# Altium schematic sheet Main.SchDoc
size A3; SheetNumber: 1; SheetTotal: 1
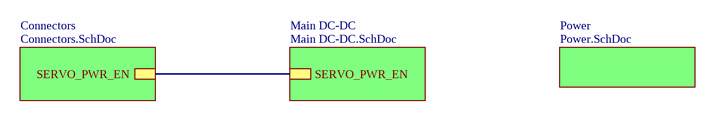
[diagram p0: Main.SchDoc]

## Sub-sheets
Connectors = Connectors.SchDoc: SERVO_PWR_EN
Main DC-DC = Main DC-DC.SchDoc: SERVO_PWR_EN
Power = Power.SchDoc: no entries

## Nets
(unnamed): sheet Connectors/SERVO_PWR_EN, sheet Main DC-DC/SERVO_PWR_EN